# EAGLE design tinynumitronboard-extended (EAGLE 6.3)
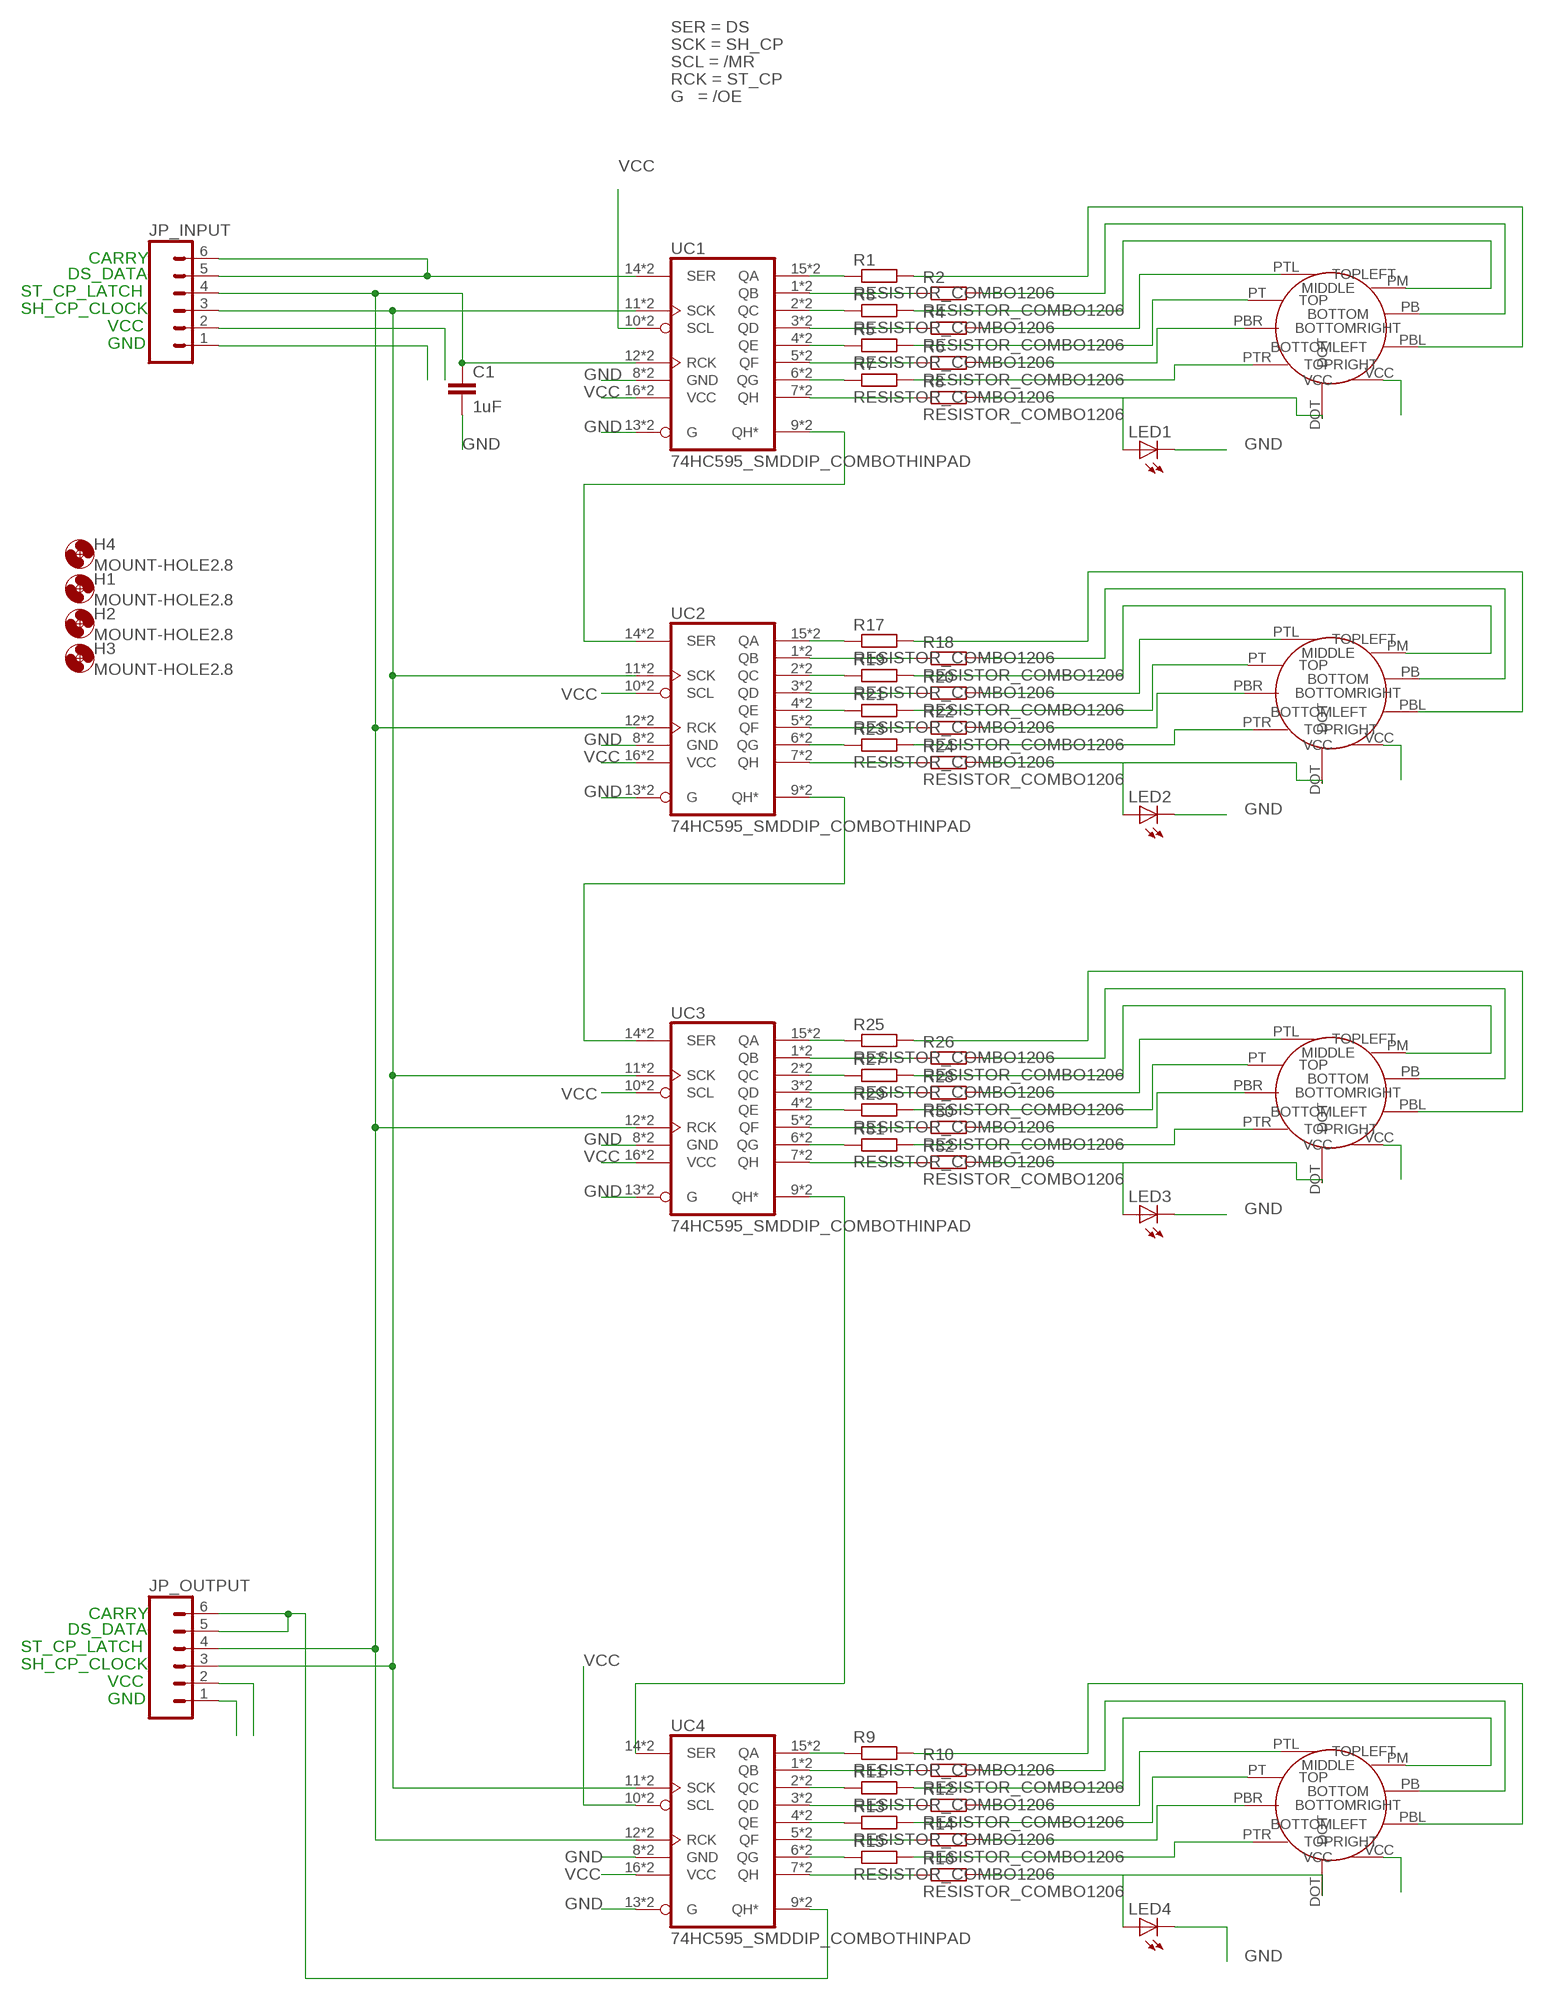
[diagram p0: schematic, sheet 1]

## Parts
C1  1uF  C-EU050-024X044  [C050-024X044]
H1  MOUNT-HOLE2.8  [2,8]
H2  MOUNT-HOLE2.8  [2,8]
H3  MOUNT-HOLE2.8  [2,8]
H4  MOUNT-HOLE2.8  [2,8]
JP_INPUT  M06SIP  [1X06]
JP_OUTPUT  M06SIP  [1X06]
LED1  LEDKA-3528ASYC  [KA-3528ASYC]
LED2  LEDKA-3528ASYC  [KA-3528ASYC]
LED3  LEDKA-3528ASYC  [KA-3528ASYC]
LED4  LEDKA-3528ASYC  [KA-3528ASYC]
R1  RESISTOR_COMBO1206  [207-10_SMD_COMBO]
R2  RESISTOR_COMBO1206  [207-10_SMD_COMBO]
R3  RESISTOR_COMBO1206  [207-10_SMD_COMBO]
R4  RESISTOR_COMBO1206  [207-10_SMD_COMBO]
R5  RESISTOR_COMBO1206  [207-10_SMD_COMBO]
R6  RESISTOR_COMBO1206  [207-10_SMD_COMBO]
R7  RESISTOR_COMBO1206  [207-10_SMD_COMBO]
R8  RESISTOR_COMBO1206  [207-10_SMD_COMBO]
R9  RESISTOR_COMBO1206  [207-10_SMD_COMBO]
R10  RESISTOR_COMBO1206  [207-10_SMD_COMBO]
R11  RESISTOR_COMBO1206  [207-10_SMD_COMBO]
R12  RESISTOR_COMBO1206  [207-10_SMD_COMBO]
R13  RESISTOR_COMBO1206  [207-10_SMD_COMBO]
R14  RESISTOR_COMBO1206  [207-10_SMD_COMBO]
R15  RESISTOR_COMBO1206  [207-10_SMD_COMBO]
R16  RESISTOR_COMBO1206  [207-10_SMD_COMBO]
R17  RESISTOR_COMBO1206  [207-10_SMD_COMBO]
R18  RESISTOR_COMBO1206  [207-10_SMD_COMBO]
R19  RESISTOR_COMBO1206  [207-10_SMD_COMBO]
R20  RESISTOR_COMBO1206  [207-10_SMD_COMBO]
R21  RESISTOR_COMBO1206  [207-10_SMD_COMBO]
R22  RESISTOR_COMBO1206  [207-10_SMD_COMBO]
R23  RESISTOR_COMBO1206  [207-10_SMD_COMBO]
R24  RESISTOR_COMBO1206  [207-10_SMD_COMBO]
R25  RESISTOR_COMBO1206  [207-10_SMD_COMBO]
R26  RESISTOR_COMBO1206  [207-10_SMD_COMBO]
R27  RESISTOR_COMBO1206  [207-10_SMD_COMBO]
R28  RESISTOR_COMBO1206  [207-10_SMD_COMBO]
R29  RESISTOR_COMBO1206  [207-10_SMD_COMBO]
R30  RESISTOR_COMBO1206  [207-10_SMD_COMBO]
R31  RESISTOR_COMBO1206  [207-10_SMD_COMBO]
R32  RESISTOR_COMBO1206  [207-10_SMD_COMBO]
U$1  IV16TINY_NUMITRON  [IV16TINY_NUMITRON_PAC]
U$2  IV16TINY_NUMITRON  [IV16TINY_NUMITRON_PAC]
U$5  IV16TINY_NUMITRON  [IV16TINY_NUMITRON_PAC]
U$7  IV16TINY_NUMITRON  [IV16TINY_NUMITRON_PAC]
UC1  74HC595_SMDDIP_COMBOTHINPAD  [DIL16_SO16_PAC2]
UC2  74HC595_SMDDIP_COMBOTHINPAD  [DIL16_SO16_PAC2]
UC3  74HC595_SMDDIP_COMBOTHINPAD  [DIL16_SO16_PAC2]
UC4  74HC595_SMDDIP_COMBOTHINPAD  [DIL16_SO16_PAC2]

## Nets
GND: C1.2 JP_INPUT.1 JP_OUTPUT.1 LED1.C LED2.C LED3.C LED4.C UC1.8(GND) UC1.13(G) UC1.S8(GND) UC1.S13(G) UC2.8(GND) UC2.13(G) UC2.S8(GND) UC2.S13(G) UC3.8(GND) UC3.13(G) UC3.S8(GND) UC3.S13(G) UC4.8(GND) UC4.13(G) UC4.S8(GND) UC4.S13(G)
N$1: R1.2 R1.3 U$1.PBL(BOTTOMLEFT)
N$2: R2.2 R2.3 U$1.PB(BOTTOM)
N$3: R3.2 R3.3 U$1.PM(MIDDLE)
N$4: R4.2 R4.3 U$1.PTL(TOPLEFT)
N$5: R5.2 R5.3 U$1.PT(TOP)
N$6: R6.2 R6.3 U$1.PBR(BOTTOMRIGHT)
N$7: R7.2 R7.3 U$1.PTR(TOPRIGHT)
N$8: R1.1 R1.4 UC1.15(QA) UC1.S15(QA)
N$9: R2.1 R2.4 UC1.1(QB) UC1.S1(QB)
N$10: R3.1 R3.4 UC1.2(QC) UC1.S2(QC)
N$11: R4.1 R4.4 UC1.3(QD) UC1.S3(QD)
N$12: R5.1 R5.4 UC1.4(QE) UC1.S4(QE)
N$13: R6.1 R6.4 UC1.5(QF) UC1.S5(QF)
N$14: R7.1 R7.4 UC1.6(QG) UC1.S6(QG)
N$16: R8.1 R8.4 UC1.7(QH) UC1.S7(QH)
N$17: LED1.A R8.2 R8.3 U$1.DOT
N$20: R9.2 R9.3 U$2.PBL(BOTTOMLEFT)
N$21: R10.2 R10.3 U$2.PB(BOTTOM)
N$22: JP_OUTPUT.5 JP_OUTPUT.6 UC4.9(QH*) UC4.S9(QH*)
N$23: UC1.9(QH*) UC1.S9(QH*) UC2.14(SER) UC2.S14(SER)
N$24: R11.2 R11.3 U$2.PM(MIDDLE)
N$25: R12.2 R12.3 U$2.PTL(TOPLEFT)
N$26: R13.2 R13.3 U$2.PT(TOP)
N$27: R14.2 R14.3 U$2.PBR(BOTTOMRIGHT)
N$28: R15.2 R15.3 U$2.PTR(TOPRIGHT)
N$29: R9.1 R9.4 UC4.15(QA) UC4.S15(QA)
N$30: R10.1 R10.4 UC4.1(QB) UC4.S1(QB)
N$31: R11.1 R11.4 UC4.2(QC) UC4.S2(QC)
N$32: R12.1 R12.4 UC4.3(QD) UC4.S3(QD)
N$33: R13.1 R13.4 UC4.4(QE) UC4.S4(QE)
N$34: R14.1 R14.4 UC4.5(QF) UC4.S5(QF)
N$35: R15.1 R15.4 UC4.6(QG) UC4.S6(QG)
N$36: R16.1 R16.4 UC4.7(QH) UC4.S7(QH)
N$37: LED4.A R16.2 R16.3 U$2.DOT
N$39: R17.2 R17.3 U$5.PBL(BOTTOMLEFT)
N$40: R18.2 R18.3 U$5.PB(BOTTOM)
N$41: R19.2 R19.3 U$5.PM(MIDDLE)
N$42: R20.2 R20.3 U$5.PTL(TOPLEFT)
N$43: R21.2 R21.3 U$5.PT(TOP)
N$44: R22.2 R22.3 U$5.PBR(BOTTOMRIGHT)
N$45: R23.2 R23.3 U$5.PTR(TOPRIGHT)
N$46: R17.1 R17.4 UC2.15(QA) UC2.S15(QA)
N$47: R18.1 R18.4 UC2.1(QB) UC2.S1(QB)
N$48: R19.1 R19.4 UC2.2(QC) UC2.S2(QC)
N$49: R20.1 R20.4 UC2.3(QD) UC2.S3(QD)
N$50: R21.1 R21.4 UC2.4(QE) UC2.S4(QE)
N$51: R22.1 R22.4 UC2.5(QF) UC2.S5(QF)
N$52: R23.1 R23.4 UC2.6(QG) UC2.S6(QG)
N$53: R24.1 R24.4 UC2.7(QH) UC2.S7(QH)
N$54: LED2.A R24.2 R24.3 U$5.DOT
N$58: UC2.9(QH*) UC2.S9(QH*) UC3.14(SER) UC3.S14(SER)
N$62: R25.2 R25.3 U$7.PBL(BOTTOMLEFT)
N$63: R26.2 R26.3 U$7.PB(BOTTOM)
N$64: R27.2 R27.3 U$7.PM(MIDDLE)
N$65: R28.2 R28.3 U$7.PTL(TOPLEFT)
N$66: R29.2 R29.3 U$7.PT(TOP)
N$67: R30.2 R30.3 U$7.PBR(BOTTOMRIGHT)
N$68: R31.2 R31.3 U$7.PTR(TOPRIGHT)
N$69: R25.1 R25.4 UC3.15(QA) UC3.S15(QA)
N$70: R26.1 R26.4 UC3.1(QB) UC3.S1(QB)
N$71: R27.1 R27.4 UC3.2(QC) UC3.S2(QC)
N$72: R28.1 R28.4 UC3.3(QD) UC3.S3(QD)
N$73: R29.1 R29.4 UC3.4(QE) UC3.S4(QE)
N$74: R30.1 R30.4 UC3.5(QF) UC3.S5(QF)
N$75: R31.1 R31.4 UC3.6(QG) UC3.S6(QG)
N$76: R32.1 R32.4 UC3.7(QH) UC3.S7(QH)
N$77: LED3.A R32.2 R32.3 U$7.DOT
N$78: UC3.9(QH*) UC3.S9(QH*) UC4.14(SER) UC4.S14(SER)
RCK: C1.1 JP_INPUT.4 JP_OUTPUT.4 UC1.12(RCK) UC1.S12(RCK) UC2.12(RCK) UC2.S12(RCK) UC3.12(RCK) UC3.S12(RCK) UC4.12(RCK) UC4.S12(RCK)
SCK: JP_INPUT.3 JP_OUTPUT.3 UC1.11(SCK) UC1.S11(SCK) UC2.11(SCK) UC2.S11(SCK) UC3.11(SCK) UC3.S11(SCK) UC4.11(SCK) UC4.S11(SCK)
SER: JP_INPUT.5 JP_INPUT.6 UC1.14(SER) UC1.S14(SER)
VCC: JP_INPUT.2 JP_OUTPUT.2 U$1.VCC U$2.VCC U$5.VCC U$7.VCC UC1.10(SCL) UC1.16(VCC) UC1.S10(SCL) UC1.S16(VCC) UC2.10(SCL) UC2.16(VCC) UC2.S10(SCL) UC2.S16(VCC) UC3.10(SCL) UC3.16(VCC) UC3.S10(SCL) UC3.S16(VCC) UC4.10(SCL) UC4.16(VCC) UC4.S10(SCL) UC4.S16(VCC)

## Notes on the sheet
- SER = DS
- SCK = SH_CP
- SCL = /MR
- RCK = ST_CP
- G   = /OE
- CARRY
- DS_DATA
- ST_CP_LATCH
- SH_CP_CLOCK
- VCC
- GND
- CARRY
- DS_DATA
- ST_CP_LATCH
- SH_CP_CLOCK
- VCC
- GND

## Library data of the parts
C1 = resistor:C-EU: CAPACITOR, European symbol
H1-H4 = holes:MOUNT-HOLE: MOUNTING HOLE with drill center marker
JP_INPUT JP_OUTPUT = SparkFun:M06: Header 6 Standard 6-pin 0.1" header. Use with straight break away headers (SKU : PRT-00116), right angle break away headers (PRT-00553), swiss pins (PRT-00743), machine pins (PRT-00117), and female headers (PRT-00115). Molex polarized connector foot print use with SKU : PRT-08094 with associated crimp pins and housings. NOTES ON THE VARIANTS LOCK and LOCK_LONGPADS... This footprint was designed to help hold the alignment of a through-hole component (i.e. 6-pin header) while soldering it into place. You may notice that each hole has been shifted either up or down by 0.005 of an inch from it's more standard position (which is a perfectly straight line). This slight alteration caused the pins (the squares in the middle) to touch the edges of the holes. Because they are alternating, it causes a "brace" to hold the component in place. 0.005 has proven to be the perfect amount of "off-center" position when using our standard breakaway headers. Although looks a little odd when you look at the bare footprint, once you have a header in there, the alteration is very hard to notice. Also, if you push a header all the way into place, it is covered up entirely on the bottom side. This idea of altering the position of holes to aid alignment will be further integrated into the Sparkfun Library for other footprints. It can help hold any component with 3 or more connection pins.
LED1-LED4 = led:LED: LED OSRAM: - CHIPLED LG R971, LG N971, LY N971, LG Q971, LY Q971, LO R971, LY R971 LH N974, LH R974 LS Q976, LO Q976, LY Q976 LO Q996 - Hyper CHIPLED LW Q18S LB Q993, LB Q99A, LB R99A - SideLED LS A670, LO A670, LY A670, LG A670, LP A670 LB A673, LV A673, LT A673, LW A673 LH A674 LY A675 LS A676, LA A676, LO A676, LY A676, LW A676 LS A679, LY A679, LG A679 - Hyper Micro SIDELED® LS Y876, LA Y876, LO Y876, LY Y876 LT Y87S - SmartLED LW L88C, LW L88S LB L89C, LB L89S, LG L890 LS L89K, LO L89K, LY L89K LS L896, LA L896, LO L896, LY L896 - TOPLED LS T670, LO T670, LY T670, LG T670, LP T670 LSG T670, LSP T670, LSY T670, LOP T670, LYG T670 LG T671, LOG T671, LSG T671 LB T673, LV T673, LT T673, LW T673 LH T674 LS T676, LA T676, LO T676, LY T676, LB T676, LH T676, LSB T676, LW T676 LB T67C, LV T67C, LT T67C, LS T67K, LO T67K, LY T67K, LW E67C LS E67B, LA E67B, LO E67B, LY E67B, LB E67C, LV E67C, LT E67C LW T67C LS T679, LY T679, LG T679 LS T770, LO T770, LY T770, LG T770, LP T770 LB T773, LV T773, LT T773, LW T773 LH T774 LS E675, LA E675, LY E675, LS T675 LS T776, LA T776, LO T776, LY T776, LB T776 LHGB T686 LT T68C, LB T68C - Hyper Mini TOPLED® LB M676 - Mini TOPLED Santana® LG M470 LS M47K, LO M47K, LY M47K Source: http://www.osram.convergy.de LUXEON: - LUMILED® LXK2-PW12-R00, LXK2-PW12-S00, LXK2-PW14-U00, LXK2-PW14-V00 LXK2-PM12-R00, LXK2-PM12-S00, LXK2-PM14-U00 LXK2-PE12-Q00, LXK2-PE12-R00, LXK2-PE12-S00, LXK2-PE14-T00, LXK2-PE14-U00 LXK2-PB12-K00, LXK2-PB12-L00, LXK2-PB12-M00, LXK2-PB14-N00, LXK2-PB14-P00, LXK2-PB14-Q00 LXK2-PR12-L00, LXK2-PR12-M00, LXK2-PR14-Q00, LXK2-PR14-R00 LXK2-PD12-Q00, LXK2-PD12-R00, LXK2-PD12-S00 LXK2-PH12-R00, LXK2-PH12-S00 LXK2-PL12-P00, LXK2-PL12-Q00, LXK2-PL12-R00 Source: www.luxeon.com KINGBRIGHT: KA-3528ASYC Source: www.kingbright.com
R1-R32 = kalshagar:RESISTOR_COMBO1206
U$1 U$2 U$5 U$7 = kalshagar:IV16TINY_NUMITRON
UC1-UC4 = kalshagar:74HC595_SMDDIP_COMBO

## Board
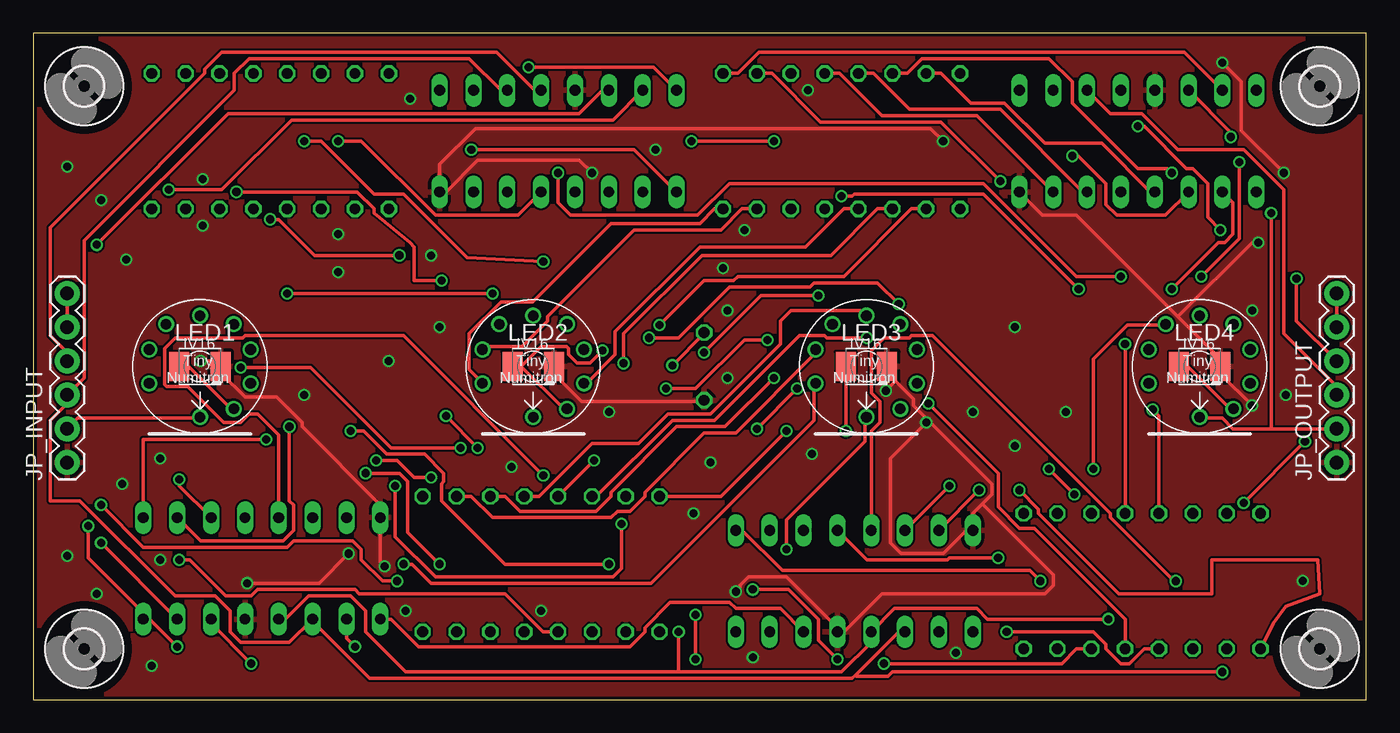
[diagram p1: board, top side]
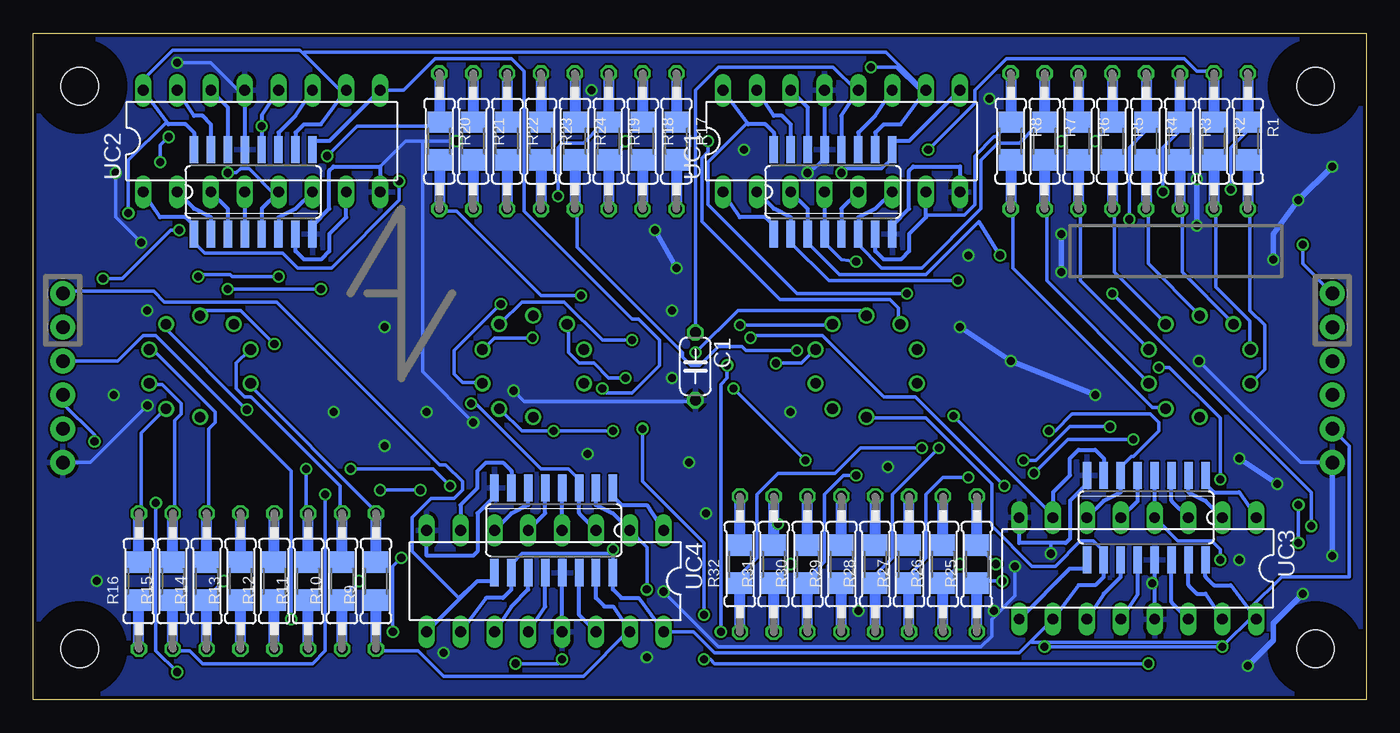
[diagram p2: board, bottom side, seen from below]

Size 100 x 50 mm. Coordinates in mm from the lower left corner, seen from the top.
Outline: 0,0 100,0 100,50 0,50 0,0
Copper layers (1*2*15*16): Top 0.035mm / dielectric 0.2mm / layer 2 0.0175mm / dielectric 1.1mm / layer 15 0.0175mm / dielectric 0.2mm / Bottom 0.035mm
Design rules "SeeedStudio_DRU_no_angle_20130527": minimum track width 6mil, minimum drill 12mil, track to track 6mil, track to pad 6mil, pad to pad 6mil, via to via 6mil, smd to smd 0mil, copper to edge 10mil, drill to drill 10mil, minimum pad ring 6mil, minimum via ring 6mil, stop-mask expansion 2mil, vias tented up to drill 25mil, thermal gap 10mil

### Footprints (pad centres in the part's own frame; a part is rotated, then mirrored left to right if it is on the bottom)
C050-024X044 = drill 0.813 octagon: 1 -2.54,0; 2 2.54,0
2,8 = hole 2.8: 0,0
1X06 = drill 1.016 pad 1.88: 1 0,0; 2 2.54,0; 3 5.08,0; 4 7.62,0; 5 10.16,0; 6 12.7,0
KA-3528ASYC = smd 1.5 x 2.2: A -1.55,0; C 1.55,0
207-10_SMD_COMBO = drill 0.813 octagon: 1 -5.08,0; 2 5.08,0 | smd 1.6 x 1.803: 3 1.422,0; 4 -1.422,0
IV16TINY_NUMITRON_PAC = drill 0.8: DOT 2.54,-3.175; PB -3.81,1.27; PBL -3.81,-1.27; PBR 3.81,1.27; PM -2.54,3.175; PT 2.54,3.175; PTL 0,3.81; PTR 3.81,-1.27; VCC 0,-3.81
DIL16_SO16_PAC2 = drill 0.813 long: 1 -8.89,-2.54; 2 -6.35,-2.54; 3 -3.81,-2.54; 4 -1.27,-2.54; 5 1.27,-2.54; 6 3.81,-2.54; 7 6.35,-2.54; 8 8.89,-2.54; 9 8.89,5.08; 10 6.35,5.08; 11 3.81,5.08; 12 1.27,5.08; 13 -1.27,5.08; 14 -3.81,5.08; 15 -6.35,5.08; 16 -8.89,5.08 | smd 0.635 x 2.032: S1 -5.08,-5.715; S2 -3.81,-5.715; S3 -2.54,-5.715; S4 -1.27,-5.715; S5 0,-5.715; S6 1.27,-5.715; S7 2.54,-5.715; S8 3.81,-5.715; S9 3.81,0.635; S10 2.54,0.635; S11 1.27,0.635; S12 0,0.635; S13 -1.27,0.635; S14 -2.54,0.635; S15 -3.81,0.635; S16 -5.08,0.635

### Placement (x,y rotation side)
C1  50.33,25 270 bottom
H1  3.81,46.04 0 top
H2  96.52,46.04 0 top
H3  96.52,3.81 0 top
H4  3.81,3.81 0 top
JP_INPUT  2.54,17.78 90 top
JP_OUTPUT  97.79,17.78 90 top
LED1  12.5,25 0 top
LED2  37.5,25 0 top
LED3  62.5,25 0 top
LED4  87.5,25 0 top
R1  8.89,41.91 270 bottom
R2  11.43,41.91 270 bottom
R3  13.97,41.91 270 bottom
R4  16.51,41.91 270 bottom
R5  19.05,41.91 270 bottom
R6  21.59,41.91 270 bottom
R7  24.13,41.91 270 bottom
R8  26.67,41.91 270 bottom
R9  74.3,8.89 90 bottom
R10  76.83,8.89 90 bottom
R11  79.38,8.89 90 bottom
R12  81.92,8.89 90 bottom
R13  84.45,8.89 90 bottom
R14  87,8.89 90 bottom
R15  89.53,8.89 90 bottom
R16  92.08,8.89 90 bottom
R17  51.75,41.91 270 bottom
R18  54.29,41.91 270 bottom
R19  56.83,41.91 270 bottom
R20  69.53,41.91 270 bottom
R21  66.99,41.91 270 bottom
R22  64.45,41.91 270 bottom
R23  61.91,41.91 270 bottom
R24  59.37,41.91 270 bottom
R25  29.21,10.16 90 bottom
R26  31.75,10.16 90 bottom
R27  34.29,10.16 90 bottom
R28  36.83,10.16 90 bottom
R29  39.37,10.16 90 bottom
R30  41.91,10.16 90 bottom
R31  44.45,10.16 90 bottom
R32  46.99,10.16 90 bottom
U$1  12.5,25 0 top
U$2  87.5,25 0 top
U$3  [GEARS_1000X500]  1.59,0.64 0 top
U$5  37.5,25 0 top
U$7  62.5,25 0 top
UC1  39.37,40.64 0 bottom
UC2  82.87,40.64 0 bottom
UC3  17.14,11.11 180 bottom
UC4  61.59,10.16 180 bottom

### Tracks (layer width: path | path; a pad name or v marks a point on that pad's centre or on a via)
GND  (via drill 0.6, 0.61)
  Top 0.254: v12.54,25.4 13.65,25.4 13.97,25.08 LED1.C 14.13,24.92 14.13,24.45 15.88,22.7 18.26,22.7 20.16,20.8 20.16,20.48 26.04,14.61 UC3.8 26.04,10.32 v26.35,10 | v16.03,8.73 21.43,8.73 v23.65,10.95 | LED2.C 39.05,24.92 39.05,24.45 41.12,22.38 50.32,22.38 C1.2 | 71.2,14.68 71.91,15.4 71.91,16.19 66.04,22.07 66.04,22.54 64.69,23.89 | 71.2,14.68 70.48,13.97 UC4.8 70.01,12.7 68.26,10.95 65.09,10.95 64.29,11.75 64.29,18.1 v66.99,20.8 | 64.69,23.89 64.14,24.45 64.14,24.92 LED3.C | 60.64,5.08 60.8,5.08 63.66,7.94 75.88,7.94 76.52,8.57 76.52,9.37 71.2,14.68 | 64.69,23.89 v63.98,23.18 | v52.7,8.1 53.02,8.41 53.02,8.57 53.66,9.21 56.52,9.21 60.64,5.08 | 60.64,5.08 UC4.13 | v41.91,39.53 40.96,40.48 33.34,40.48 30.96,38.1 UC1.8 30.48,40.16 33.18,42.86 67.31,42.86 v68.26,41.91 | 85.88,28.73 78.26,36.35 75.72,36.35 UC2.8 | 85.88,28.73 88.9,25.72 88.9,25.08 LED4.C 89.06,24.92 89.06,24.45 v91.44,22.07 | v89.22,47.78 90.65,46.35 90.65,42.7 v93.82,39.53 | v91.92,34.29 91.44,34.29 85.88,28.73
  Bottom 0.254: 20.95,16.19 UC3.S8 | JP_INPUT.1 4.92,17.78 v12.54,25.4 | v16.03,8.73 15.88,8.73 UC3.13 | v23.65,10.95 23.65,11.75 22.54,11.75 | 65.41,15.24 UC4.S8 | v63.98,23.18 63.18,22.38 50.48,22.38 C1.2 | v26.35,10 26.35,7.78 28.1,6.03 28.1,4.76 28.89,3.97 48.58,3.97 v52.7,8.1 | 35.56,35.56 UC1.S8 | v41.91,39.53 41.59,39.85 41.43,39.85 40.64,40.64 UC1.S13 | UC2.S8 79.06,35.56 77.79,36.83 | JP_OUTPUT.1 95.73,17.78 v91.44,22.07 | UC2.13 84.61,45.72 86.68,47.78 v89.22,47.78 | v93.82,39.53 93.82,36.2 v91.92,34.29 | 70.8,41.91 72.07,41.91 73.98,40.01 | 70.8,41.91 v68.26,41.91 | v66.99,20.8 70.8,24.61 70.8,41.91
  Bottom 0.406: v20.32,22.86 v26.67,25.4 v30.48,27.94 | v6.99,33.02 6.99,34.92 v5.08,37.47 v2.54,40.01 | JP_INPUT.1 v2.54,10.79 | v4.76,7.94 6.99,5.71 6.99,4.45 v8.89,2.54 | v6.67,16.19 v9.53,18.1 | v22.86,32.07 v22.86,34.92 | v51.75,32.38 v53.34,35.24 | v12.7,35.56 v12.7,39.05
  other vias: 73.66,27.94 70.48,21.59 58.42,18.41 50.8,17.78 49.53,13.97 53.98,3.17 46.67,41.27 93.98,22.86 52.07,29.21 52.07,24.13 29.84,33.34 28.26,45.09 9.53,10.48 27.94,6.67 35.88,17.46 38.1,6.67 77.47,21.59 91.44,29.21 43.18,21.59 58.1,45.72 69.22,3.49 73.66,19.05 95.25,8.89
  pour Top: -1.27,52.07 101.6,52.07 101.6,-1.27 -1.27,-1.27
  pour Bottom: -1.27,52.07 101.6,52.07 101.6,-2.54 -1.27,-2.54
N$1
  Bottom 0.254: R1.3 R1.2 8.73,36.51 8.73,29.21 7.62,28.1 7.62,24.77 8.57,23.81 U$1.PBL
N$2
  Bottom 0.254: R2.3 R2.2 11.27,36.51 11.27,30.96 8.73,28.42 8.73,26.35 U$1.PB
N$3
  Bottom 0.254: R3.3 R3.2 13.81,36.51 13.81,32.07 10,28.26 U$1.PM
N$4
  Bottom 0.254: R4.3 R4.2 16.35,36.51 16.35,32.7 12.54,28.89 U$1.PTL
N$5
  Bottom 0.254: R5.3 R5.2 18.89,36.51 18.89,32.07 15.08,28.26 U$1.PT
N$6
  Bottom 0.254: R6.3 R6.2 21.43,36.51 21.43,31.43 16.35,26.35 U$1.PBR
N$7
  Bottom 0.254: R7.3 R7.2 23.97,36.51 23.97,31.43 16.35,23.81 U$1.PTR
N$8  (via drill 0.61)
  Top 0.254: v10.16,38.26 14.13,38.26 19.37,43.5 43.5,43.5 UC1.15
  Bottom 0.254: R1.4 | R1.4 8.89,43.18 | v10.16,38.26 10.16,41.43 9.05,42.55 9.05,42.86 R1.4
N$9  (via drill 0.61)
  Top 0.254: v32.86,41.27 45.09,41.27 UC1.1
  Bottom 0.254: R2.4 11.43,43.18 | v32.86,41.27 29.37,44.77 29.37,45.72 26.99,48.1 13.65,48.1 12.7,47.15 11.75,47.15 R2.1 | 44.45,35.56 UC1.S1
N$10  (via drill 0.61)
  Top 0.254: v15.24,38.1 24.29,38.1 25.56,36.83 25.56,36.51 28.26,34.29 28.57,33.97 28.57,31.43 v30.64,31.43
  Bottom 0.254: R3.4 | R3.4 13.97,43.18 | v15.24,38.1 15.24,41.43 14.13,42.55 14.13,42.86 R3.4 | v30.64,31.43 40.32,31.43 43.18,34.29 UC1.S2
N$11  (via drill 0.61)
  Top 0.254: v17.78,36.04 18.41,36.04 21.11,33.34 v27.46,33.34
  Bottom 0.254: R4.4 | R4.4 16.51,43.18 | v17.78,36.04 17.78,41.43 16.67,42.55 16.67,42.86 R4.4 | v27.46,33.34 29.05,35.88 33.02,31.91 39.53,31.91 41.91,34.29 UC1.S3
N$12  (via drill 0.61)
  Top 0.254: v20.32,41.91 21.59,41.91 25.56,37.94 27.78,37.94 32.54,33.18 v38.26,32.86
  Bottom 0.254: R5.4 | R5.4 19.05,43.18 | v20.32,41.91 20.32,42.07 19.37,43.02 R5.4 | v38.26,32.86 39.37,33.02 40.64,34.29 UC1.S4
N$13  (via drill 0.61)
  Top 0.254: v22.86,41.91 24.61,41.91 30.16,36.35 36.35,36.35 UC1.5
  Bottom 0.254: R6.4 | R6.4 21.59,43.18 | v22.86,41.91 22.86,42.07 21.91,43.02 R6.4 | 39.37,35.56 UC1.S5
N$14
  Bottom 0.254: R7.4 | R7.4 24.13,43.18 | UC1.S6 38.1,34.13 36.35,32.38 33.34,32.38 28.89,36.83 28.89,40.48 27.62,41.75 26.04,41.75 24.77,43.02 24.45,43.02 R7.4
N$16
  Bottom 0.254: R8.4 | R8.4 26.67,43.18 | R8.4 26.99,43.02 27.78,42.23 27.94,42.23 29.37,40.8 29.37,37.15 30.16,36.35 33.02,36.35 33.02,36.2
N$17
  Top 0.254: LED1.A 10.95,24.92 11.75,24.92 14.92,21.75 U$1.DOT
  Bottom 0.254: R8.3 R8.2 26.51,36.51 26.51,32.38 16.03,21.91 15.08,21.91 U$1.DOT
N$20
  Bottom 0.254: R9.3 74.3,10.16 | R9.2 74.45,14.29 83.82,23.65 U$2.PBL
N$21
  Bottom 0.254: R10.3 76.83,10.16 | R10.2 76.99,14.29 76.99,16.03 83.66,22.7 84.14,22.7 84.77,23.34 84.77,25.24 83.82,26.19 U$2.PB
N$22
  Top 0.254: JP_OUTPUT.6 JP_OUTPUT.5
  Bottom 0.254: 65.41,8.89 UC4.S9 | JP_OUTPUT.6 97.63,30.64 90.96,30.64 90.17,29.84 81.76,29.84 69.53,17.62 69.06,17.62 67.79,16.35 67.79,15.72 68.42,15.08 70.17,15.08 71.6,13.65 71.6,11.11 68.1,7.62 66.67,8.89
N$23  (via drill 0.61)
  Top 0.254: v39.37,39.53 39.37,37.31 40.32,36.35 49.85,36.35 52.23,38.73 71.28,38.73 78.26,31.75 v81.6,31.75 | v87.63,31.75 90.49,34.61 v90.49,40.32 | v89.85,42.23 89.85,42.55 UC2.14
  Bottom 0.254: 34.29,41.91 35.56,41.91 UC1.S9 35.56,40.64 36.35,39.85 39.05,39.85 v39.37,39.53 | v81.6,31.75 85.09,31.75 85.25,31.91 87.47,31.91 v87.63,31.75 | v90.49,40.32 90.49,41.59 v89.85,42.23
N$24  (via drill 0.61)
  Top 0.254: v79.53,17.3 79.53,25.56 82.07,28.1 84.93,28.1 U$2.PM
  Bottom 0.254: R11.3 79.38,10.16 | v79.53,17.3 79.53,14.29 R11.2
N$25  (via drill 0.61)
  Top 0.254: v81.92,26.67 R12.2
  Bottom 0.254: R12.3 81.92,10.16 | v81.92,26.67 84.45,29.21 87.15,29.21 87.47,28.89 U$2.PTL
N$26  (via drill 0.61)
  Top 0.254: R13.2 84.45,21.27 v83.98,21.75
  Bottom 0.254: R13.3 84.45,10.16 | v83.98,21.75 90.01,27.78 90.01,28.1 U$2.PT
N$27
  Bottom 0.254: R14.3 87,10.16 | R14.2 86.84,14.29 86.84,20.32 86.36,20.8 86.36,21.59 90.96,26.19 91.28,26.19 U$2.PBR
N$28
  Bottom 0.254: R15.3 89.53,10.16 | R15.2 89.38,14.29 89.38,20.95 88.9,21.43 88.9,22.23 90.33,23.65 91.28,23.65 U$2.PTR
N$29
  Bottom 0.254: R9.4 R9.1 73.98,3.65 71.12,3.65 69.22,1.75 58.74,1.75 55.4,5.08 UC4.15
N$30  (via drill 0.61)
  Top 0.254: UC4.1 53.18,12.7 56.2,9.68 74.77,9.68 v75.56,8.89
  Bottom 0.254: UC4.S1 56.52,15.24 55.88,14.61 | R10.1 R10.4 76.68,7.78 v75.56,8.89
N$31  (via drill 0.61)
  Top 0.254: R11.1 78.26,3.81 77.15,2.7 v63.82,2.7 | v60.33,3.02 58.9,4.45 58.9,6.03 56.67,8.26 v53.98,8.26
  Bottom 0.254: R11.4 R11.1 | v63.82,2.7 60.64,2.7 v60.33,3.02 | v53.98,8.26 53.98,11.43 UC4.2
N$32  (via drill 0.61)
  Top 0.254: R12.1 81.92,6.03 75.09,12.86 73.98,12.86 72.39,14.45 72.39,16.99 v67.15,22.23
  Bottom 0.254: R12.4 R12.1 | v67.15,22.23 66.83,22.23 61.91,17.3 59.85,17.3 59.05,16.51 UC4.S3
N$33  (via drill 0.61)
  Top 0.254: R13.1 83.34,3.81 82.23,2.7 81.6,2.7 80.49,3.81 80.49,4.13 79.53,5.08 v73.03,5.08 | v72.39,10.64 68.74,10.64 68.58,10.48 62.55,10.48 UC4.4
  Bottom 0.254: R13.4 R13.1 | v73.03,5.08 73.03,10 v72.39,10.64
N$34  (via drill 0.61)
  Top 0.254: UC4.5 62.87,20.16 63.5,20.8 63.5,22.38 62.87,23.02 62.87,26.19 63.82,27.15 65.72,27.15 65.88,27.3 67.47,27.3 80.8,13.97 80.8,13.65 85.57,8.89 v85.72,8.89
  Bottom 0.254: UC4.S5 61.59,15.24 61.59,13.97 | R14.1 R14.4 86.84,7.78 v85.72,8.89
N$35  (via drill 0.61)
  Top 0.254: v76.2,17.3 v78.11,15.4 | UC4.6 v68.74,16.03
  Bottom 0.254: R15.4 R15.1 89.22,3.65 88.27,3.65 87.31,2.7 79.06,2.7 78.11,3.65 v78.11,15.4 | v76.2,17.3 70.01,17.3 v68.74,16.03
N$36  (via drill 0.61)
  Top 0.254: R16.1 93.03,5.71 93.98,6.99 96.52,7.94 96.36,10.48 88.42,10.48 88.42,7.94 81.44,7.94 75.41,13.97 75.41,14.29 v73.98,15.72 | UC4.7 v70.96,15.72
  Bottom 0.254: R16.4 R16.1 | v70.96,15.72 v73.98,15.72
N$37
  Top 0.254: LED4.A 86.04,24.92 86.68,24.92 89.69,21.91 90.01,21.91 U$2.DOT
  Bottom 0.254: R16.3 92.08,10.16 | R16.2 91.92,14.29 91.92,20 90.17,21.75 U$2.DOT
N$39
  Top 0.254: R17.2 51.12,36.83 50.01,35.72 43.34,35.72 37.47,29.84 35.08,29.84 32.7,27.46 32.7,24.77 33.66,23.81 U$5.PBL
  Bottom 0.254: R17.3 R17.2
N$40
  Top 0.254: R18.2 53.18,36.83 51.59,35.24 45.09,35.24 38.58,28.73 38.58,28.42 36.67,26.51 33.97,26.51 33.81,26.35 U$5.PB
  Bottom 0.254: R18.3 R18.2
N$41  (via drill 0.61)
  Top 0.254: v49.37,41.91 v55.56,41.91
  Bottom 0.254: R19.2 R19.3 56.52,40.8 55.56,41.75 v55.56,41.91 | v49.37,41.91 49.37,41.12 49.85,40.64 49.85,35.88 43.97,30 35.72,30 35.08,29.37 35.08,28.26 U$5.PM
N$42  (via drill 0.61)
  Top 0.254: v58.9,30.32 54.61,30.32 v50.32,26.04
  Bottom 0.254: R20.3 R20.2 69.22,36.67 68.26,36.67 61.91,30.32 v58.9,30.32 | v50.32,26.04 47.15,29.21 37.94,29.21 37.62,28.89 U$5.PTL
N$43  (via drill 0.61)
  Top 0.254: R21.2 65.88,36.83 60.8,31.75 52.86,31.75 52.55,31.43 50.32,31.43 v46.99,28.1
  Bottom 0.254: R21.3 R21.2 | v46.99,28.1 40.16,28.1 U$5.PT
N$44  (via drill 0.61)
  Top 0.254: R22.2 63.34,36.83 59.85,33.34 50.16,33.34 44.29,27.46 v44.29,25.24
  Bottom 0.254: R22.3 R22.2 | v44.29,25.24 42.39,25.24 41.43,26.19 U$5.PBR
N$45
  Top 0.254: R23.2 60.8,36.83 57.94,33.97 50.01,33.97 43.66,27.62 43.66,25.88 41.43,23.65 U$5.PTR
  Bottom 0.254: R23.3 R23.2
N$46
  Top 0.254: R17.1 52.86,46.99 54.45,48.58 86.36,48.58 UC2.15
  Bottom 0.254: R17.4 51.75,43.18
N$47  (via drill 0.61)
  Top 0.254: R18.1 55.4,46.99 59.05,43.34 68.1,43.34 v72.55,38.89
  Bottom 0.254: R18.4 54.29,43.18 | v72.55,38.89 72.55,37.47 77.63,32.38 80.17,32.38 81.28,33.5 87.15,33.5 87.95,34.29 UC2.S1 87.95,35.56
N$48  (via drill 0.61)
  Top 0.254: v60.64,37.78 61.44,37.78 61.59,37.94 71.28,37.94 v78.42,30.8 | v85.41,30.8 88.9,34.29 89.38,34.29 90.01,34.92 90.01,37.31 UC2.2
  Bottom 0.254: R19.4 | R19.4 56.83,43.18 | v60.64,37.78 60.64,41.43 60.33,41.75 58.74,41.75 57.47,43.02 57.15,43.02 R19.4 | v85.41,30.8 v78.42,30.8
N$49  (via drill 0.61)
  Top 0.254: v77.95,40.8 78.42,40.8 80.49,38.73 80.49,37.15 81.28,36.35 84.93,36.35 UC2.3
  Bottom 0.254: R20.4 | R20.4 69.53,43.18 | v77.95,40.8 75.72,43.02 69.85,43.02 R20.4
N$50
  Top 0.254: R21.1 68.1,46.99 70.33,44.77 72.87,44.77 75.88,41.75 80.17,41.75 83.82,38.1 UC2.4
  Bottom 0.254: R21.4 66.99,43.18
N$51  (via drill 0.61)
  Top 0.254: R22.1 65.56,46.99 66.67,48.1 76.2,48.1 77.95,46.35 77.95,44.77 82.87,39.85 85.09,39.85 v85.41,39.53
  Bottom 0.254: R22.4 64.45,43.18 | v85.41,39.53 84.77,39.53 84.45,39.85 83.82,39.85 81.92,37.94 UC2.5 | 82.87,35.56 UC2.S5
N$52
  Top 0.254: R23.1 63.02,46.99 65.72,44.29 72.55,44.29 78.74,38.1 UC2.6
  Bottom 0.254: R23.4 61.91,43.18
N$53
  Top 0.254: R24.1 60.48,46.99 63.66,43.81 70.8,43.81 UC2.7
  Bottom 0.254: R24.4 59.37,43.18
N$54  (via drill 0.61)
  Top 0.254: 36.51,24.92 36.67,24.92 39.69,21.91 40.01,21.91 U$5.DOT | 36.51,24.92 36.04,24.92 LED2.A 36.51,24.92 | v42.7,26.19 41.75,25.24 40.8,25.24 40.16,25.88 40.16,26.35 40.01,26.51 38.1,26.51 36.51,24.92
  Bottom 0.254: R24.3 R24.2 59.21,36.51 59.21,33.97 51.28,26.04 51.28,25.72 50.64,25.08 50.01,25.08 48.58,26.51 46.83,26.51 46.51,26.19 v42.7,26.19
N$58  (via drill 0.61)
  Top 0.254: v54.29,20.32 v57.31,23.34 | v49.69,3.02 v49.69,6.35 | v16.35,2.7 13.34,5.71 UC3.14
  Bottom 0.254: UC2.S9 79.06,41.91 77.79,41.91 | UC2.9 72.23,45.72 69.85,48.1 64.14,48.1 63.18,47.15 63.18,36.67 55.09,28.57 54.61,28.57 53.02,26.99 53.02,25.08 55.09,23.02 56.99,23.02 v57.31,23.34 | v54.29,20.32 54.29,16.35 49.69,11.75 v49.69,6.35 | v49.69,3.02 49.21,3.02 48.9,2.7 v16.35,2.7
N$62  (via drill 0.61)
  Top 0.254: v27.78,10.16 28.42,10.16 29.84,8.73 46.35,8.73 58.58,20.95 58.58,23.65 U$7.PBL
  Bottom 0.254: R25.3 | R25.3 29.21,11.43 | v27.78,10.16 28.89,11.27 R25.3
N$63
  Top 0.254: R26.2 32.86,15.24 34.45,13.65 43.34,13.65 43.81,14.13 44.77,14.13 45.88,15.24 45.88,15.56 50.32,20 52.7,20 58.58,25.88 58.58,26.19 U$7.PB
  Bottom 0.254: R26.3 31.75,11.43
N$64  (via drill 0.61)
  Top 0.254: R27.2 35.4,15.24 36.51,14.13 42.23,14.13 43.34,15.24 43.34,15.56 48.26,20.48 51.91,20.48 v55.56,24.13
  Bottom 0.254: R27.3 34.29,11.43 | v55.56,24.13 56.83,24.13 57.94,25.24 59.05,25.24 59.85,26.04 59.85,28.1 U$7.PM
N$65
  Top 0.254: R28.2 37.94,15.24 41.91,19.21 45.4,19.21 47.62,21.43 50.8,21.43 56.04,26.67 56.04,28.42 56.83,29.21 62.07,29.21 62.39,28.89 U$7.PTL
  Bottom 0.254: R28.3 36.83,11.43
N$66  (via drill 0.61)
  Top 0.254: v42.07,17.94 R29.2 | v47.47,23.34 49.69,23.34 53.34,26.99 v55.09,26.99
  Bottom 0.254: R29.3 39.37,11.43 | v47.47,23.34 v42.07,17.94 | v55.09,26.99 57.31,26.99 60.17,29.84 63.34,29.84 64.93,28.26 U$7.PT
N$67  (via drill 0.61)
  Top 0.254: R30.2 42.23,15.24 47.94,20.95 51.12,20.95 57.47,27.3 59.37,27.3 59.53,27.15 v62.55,27.15
  Bottom 0.254: R30.3 41.91,11.43 | v62.55,27.15 65.41,27.15 66.2,26.35 U$7.PBR
N$68  (via drill 0.61)
  Top 0.254: v44.13,13.18 44.13,9.84 43.5,9.21 30.16,9.21 27.15,12.22 v27.15,16.03 | v46.2,27.15 48.42,27.15 52.23,30.96 58.26,30.96 58.58,31.27 63.34,31.27 v64.93,29.69
  Bottom 0.254: R31.3 44.45,11.43 v44.13,13.18 | v27.15,16.03 33.81,22.7 36.2,22.7 40.8,27.3 46.04,27.3 v46.2,27.15 | v64.93,29.69 68.42,26.19 68.42,24.45 67.79,23.81 66.36,23.81 U$7.PTR
N$69  (via drill 0.61)
  Top 0.254: v27.3,8.89 26.19,8.89 24.61,10.48 24.61,11.27 23.97,11.91 19.53,11.91 19.05,11.43 8.26,11.43 v5.08,14.61 | UC3.15 v5.08,11.75
  Bottom 0.254: R25.1 R25.4 28.89,8.89 v27.3,8.89 | v5.08,11.75 v5.08,14.61
N$70  (via drill 0.61)
  Top 0.254: UC3.1 8.26,19.53 v17.46,19.53 | v24.92,16.99 27.46,16.99 28.1,16.35 28.1,12.54 v30.48,10.16
  Bottom 0.254: UC3.S1 12.06,16.19 11.43,15.56 | R26.1 R26.4 31.59,9.05 v30.48,10.16 | v17.46,19.53 22.38,19.53 v24.92,16.99
N$71  (via drill 0.61)
  Top 0.254: v29.84,16.67 28.57,16.67 27.3,17.94 v25.72,17.94 | v19.21,20.48 19.21,14.92 19.53,14.61 19.53,12.7 18.73,11.91 12.54,11.91 UC3.2
  Bottom 0.254: R27.1 R27.4 34.13,9.21 34.13,9.53 33.02,10.64 33.02,15.4 31.75,16.67 v29.84,16.67 | v25.72,17.94 24.77,17.94 22.23,20.48 v19.21,20.48
N$72  (via drill 0.61)
  Top 0.254: v32.07,18.89 26.83,18.89 20.8,24.92 v15.56,24.92 | v10.95,16.51 10.95,16.03 UC3.3
  Bottom 0.254: R28.1 R28.4 36.67,9.21 36.67,9.53 35.56,10.64 35.56,15.4 v32.07,18.89 | v15.56,24.92 14.76,24.92 10.95,21.11 v10.95,16.51
N$73  (via drill 0.61)
  Top 0.254: R29.1 38.26,5.08 35.4,7.94 24.45,7.94 24.13,8.26 16.83,8.26 16.35,7.78 14.45,7.78 11.75,10.48 v10.95,10.48
  Bottom 0.254: R29.4 R29.1 | v10.95,10.48 10.95,11.27 11.59,11.91 14.13,11.91 UC3.4
N$74  (via drill 0.61)
  Top 0.254: UC3.5 18.41,19.84 16.83,21.43 16.19,21.43 15.56,20.8 14.29,20.8 11.59,23.5 10,23.5 9.84,23.65 9.84,26.35 10.64,27.15 15.72,27.15 15.88,27.3 27.78,27.3 v38.26,16.83
  Bottom 0.254: UC3.S5 17.14,16.19 17.14,14.92 | R30.1 R30.4 41.75,9.21 40.64,10.32 40.64,15.4 39.21,16.83 v38.26,16.83
N$75  (via drill 0.61)
  Top 0.254: v43.18,10.16 35.4,10.16 30.64,14.92 30.64,16.19 30.8,16.35 30.8,16.99 29.37,18.41 26.51,18.41 24.77,20.16 v23.81,20.16
  Bottom 0.254: R31.1 R31.4 44.13,9.05 43.18,10 v43.18,10.16 | v23.81,20.16 23.34,20.16 22.07,21.43 16.19,21.43 15.56,20.8 15.56,20.16 17.46,18.26 17.62,18.26 18.41,17.46 UC3.S6
N$76  (via drill 0.61)
  Top 0.254: v30.96,21.27 v33.34,18.89
  Bottom 0.254: R32.1 R32.4 46.83,9.21 46.83,9.53 45.72,10.64 45.72,15.4 44.13,16.99 39.85,16.99 37.94,18.89 v33.34,18.89 | v30.96,21.27 23.5,13.81 UC3.7
N$77  (via drill 0.61)
  Top 0.254: R32.2 51.59,15.24 v56.52,20.16 | v60.96,20.16 60.96,24.92 LED3.A
  Bottom 0.254: R32.3 46.99,11.43 | v56.52,20.16 v60.96,20.16 63.34,20.16 64.93,21.75 U$7.DOT
N$78
  Top 0.254: UC3.9 26.83,6.03 28.89,3.97 44.77,3.97 45.88,5.08 45.88,5.4 47.78,7.3 52.23,7.3 52.7,6.83 56.04,6.83 UC4.14
  Bottom 0.254: 20.95,9.84 UC3.S9
RCK  (via drill 0.61)
  Top 0.254: JP_INPUT.4 2.54,26.04 1.27,27.3 1.27,35.4 12.86,46.99 12.86,47.31 14.13,48.58 34.77,48.58 37.62,45.72 UC1.12 | v80.64,6.03 71.6,6.03 70.8,6.83 64.61,6.83 UC4.12 62.87,4.29 60.64,2.06 48.42,2.06 | UC3.12 18.89,6.03 20.64,7.78 23.81,7.78 24.92,6.67 24.92,5.08 27.94,2.06 48.42,2.06 | v82.87,43.02 83.34,43.02 86.52,39.85 87,39.85 88.11,38.73 88.11,36.2 v89.06,35.24 | v94.77,31.59 94.77,28.42 JP_OUTPUT.4 | v47.94,25.08 50.32,27.46 C1.1 | 48.42,2.06 v48.42,5.08
  Bottom 0.254: C1.1 50.32,27.62 50.32,45.72 48.58,47.47 40.01,47.47 38.26,45.72 UC1.12 | JP_OUTPUT.4 93.66,25.4 91.76,27.3 90.81,27.3 80.64,17.14 v80.64,6.03 | v89.06,35.24 89.69,35.24 93.34,31.59 v94.77,31.59 | v82.87,43.02 UC2.S12 | v47.94,25.08 47.94,24.13 48.42,23.65 v48.42,5.08
SCK  (via drill 0.61)
  Top 0.254: JP_OUTPUT.3 97.79,23.5 93.82,27.46 93.82,38.26 90.81,41.27 85.88,41.27 83.19,43.97 80.8,43.97 UC2.11 | UC1.11 35.08,45.72 32.7,48.1 16.19,48.1 15.08,46.99 15.08,45.72 3.81,34.45 3.81,24.13 JP_INPUT.3 2.54,22.23 1.27,20.95 1.27,14.92 3.49,14.92 10.64,7.78 13.65,7.78 14.76,6.67 14.76,5.08 15.56,4.29 19.21,4.29 UC3.11 20.95,5.87 25.24,1.59 61.44,1.59 61.67,1.83 | UC4.11 64.93,5.08 61.67,1.83 | v90.81,14.76 v95.41,19.37 | v89.22,2.06 64.45,2.06 64.14,1.75 61.75,1.75 61.67,1.83
  Bottom 0.254: JP_OUTPUT.3 97.79,22.23 95.41,19.84 v95.41,19.37 | v90.81,14.76 90.81,3.65 v89.22,2.06
SER  (via drill 0.61)
  Top 0.254: JP_INPUT.6 JP_INPUT.5 | UC1.14 42.7,45.72 40.96,43.97 14.61,43.97 v4.76,34.13
  Bottom 0.254: v4.76,34.13 4.76,32.7 JP_INPUT.6
VCC  (via drill 0.61)
  Top 0.254: JP_INPUT.2 3.33,21.11 12.38,21.11 U$1.VCC | v56.52,11.27 56.52,13.49 62.39,19.37 62.39,21.11 U$7.VCC | JP_OUTPUT.2 92.87,20.32 | 92.87,20.32 90.01,20.32 89.22,21.11 87.63,21.11 U$2.VCC | v37.15,47.47 46.51,47.47 UC1.16 | v92.87,36.51 92.87,20.32 | UC3.10 23.5,4.6 v24.13,3.97 | v10.79,3.97 4.13,10.64 v4.13,13.02 | v34.45,30.48 v19.05,30.48
  Bottom 0.254: JP_INPUT.2 1.27,19.05 1.27,9.21 6.35,9.21 8.73,6.83 UC3.16 8.73,6.03 10.48,4.29 25.08,4.29 25.16,4.37 | UC4.S16 56.52,10.95 | UC4.S10 64.14,10.16 63.34,10.95 56.52,10.95 | 56.52,10.95 v56.52,11.27 | UC3.S10 19.68,11.11 20.48,11.91 21.43,11.91 23.34,10 25.08,10 28.1,13.02 28.1,16.19 33.02,21.11 37.47,21.11 U$5.VCC | UC4.16 50.48,5.08 48.9,3.49 26.04,3.49 25.16,4.37 | UC3.10 25.16,4.37 | 33.18,45.72 33.5,45.72 35.24,47.47 v37.15,47.47 | UC2.10 76.99,45.72 79.77,48.5 | 79.77,48.5 80.01,48.74 89.53,48.74 91.6,46.67 91.6,45.72 UC2.16 | 33.18,45.72 36.04,48.58 79.69,48.58 79.77,48.5 | 33.18,45.72 UC1.10 | v92.87,36.51 92.87,40.48 90.01,43.34 89.85,43.18 | v10.79,3.97 v24.13,3.97 | v4.13,13.02 4.13,15.56 v19.05,30.48 | v34.45,30.48 42.7,30.48 49.37,37.15 49.37,40.32 46.51,43.18 46.35,43.18

### Text on the board
bDocu: http://kalshagar.wikispaces.com/Alan+numitron+clock | 74xx595 | 74xx595 | [OUT] | [IN] | Dot/LED | Dot/LED | All resistors:100Ω / LED:470Ω | DATA(in) | DATA(out) | 1uF | LTCH | LTCH | CLK | CLK | VCC | VCC | GND | GND | Dot/LED | 74xx595 | 74xx595 | Dot/LED | Alan numitron clock (v1.0 - July 2013)